# EAGLE design CR1000X small (EAGLE 9.6.2)
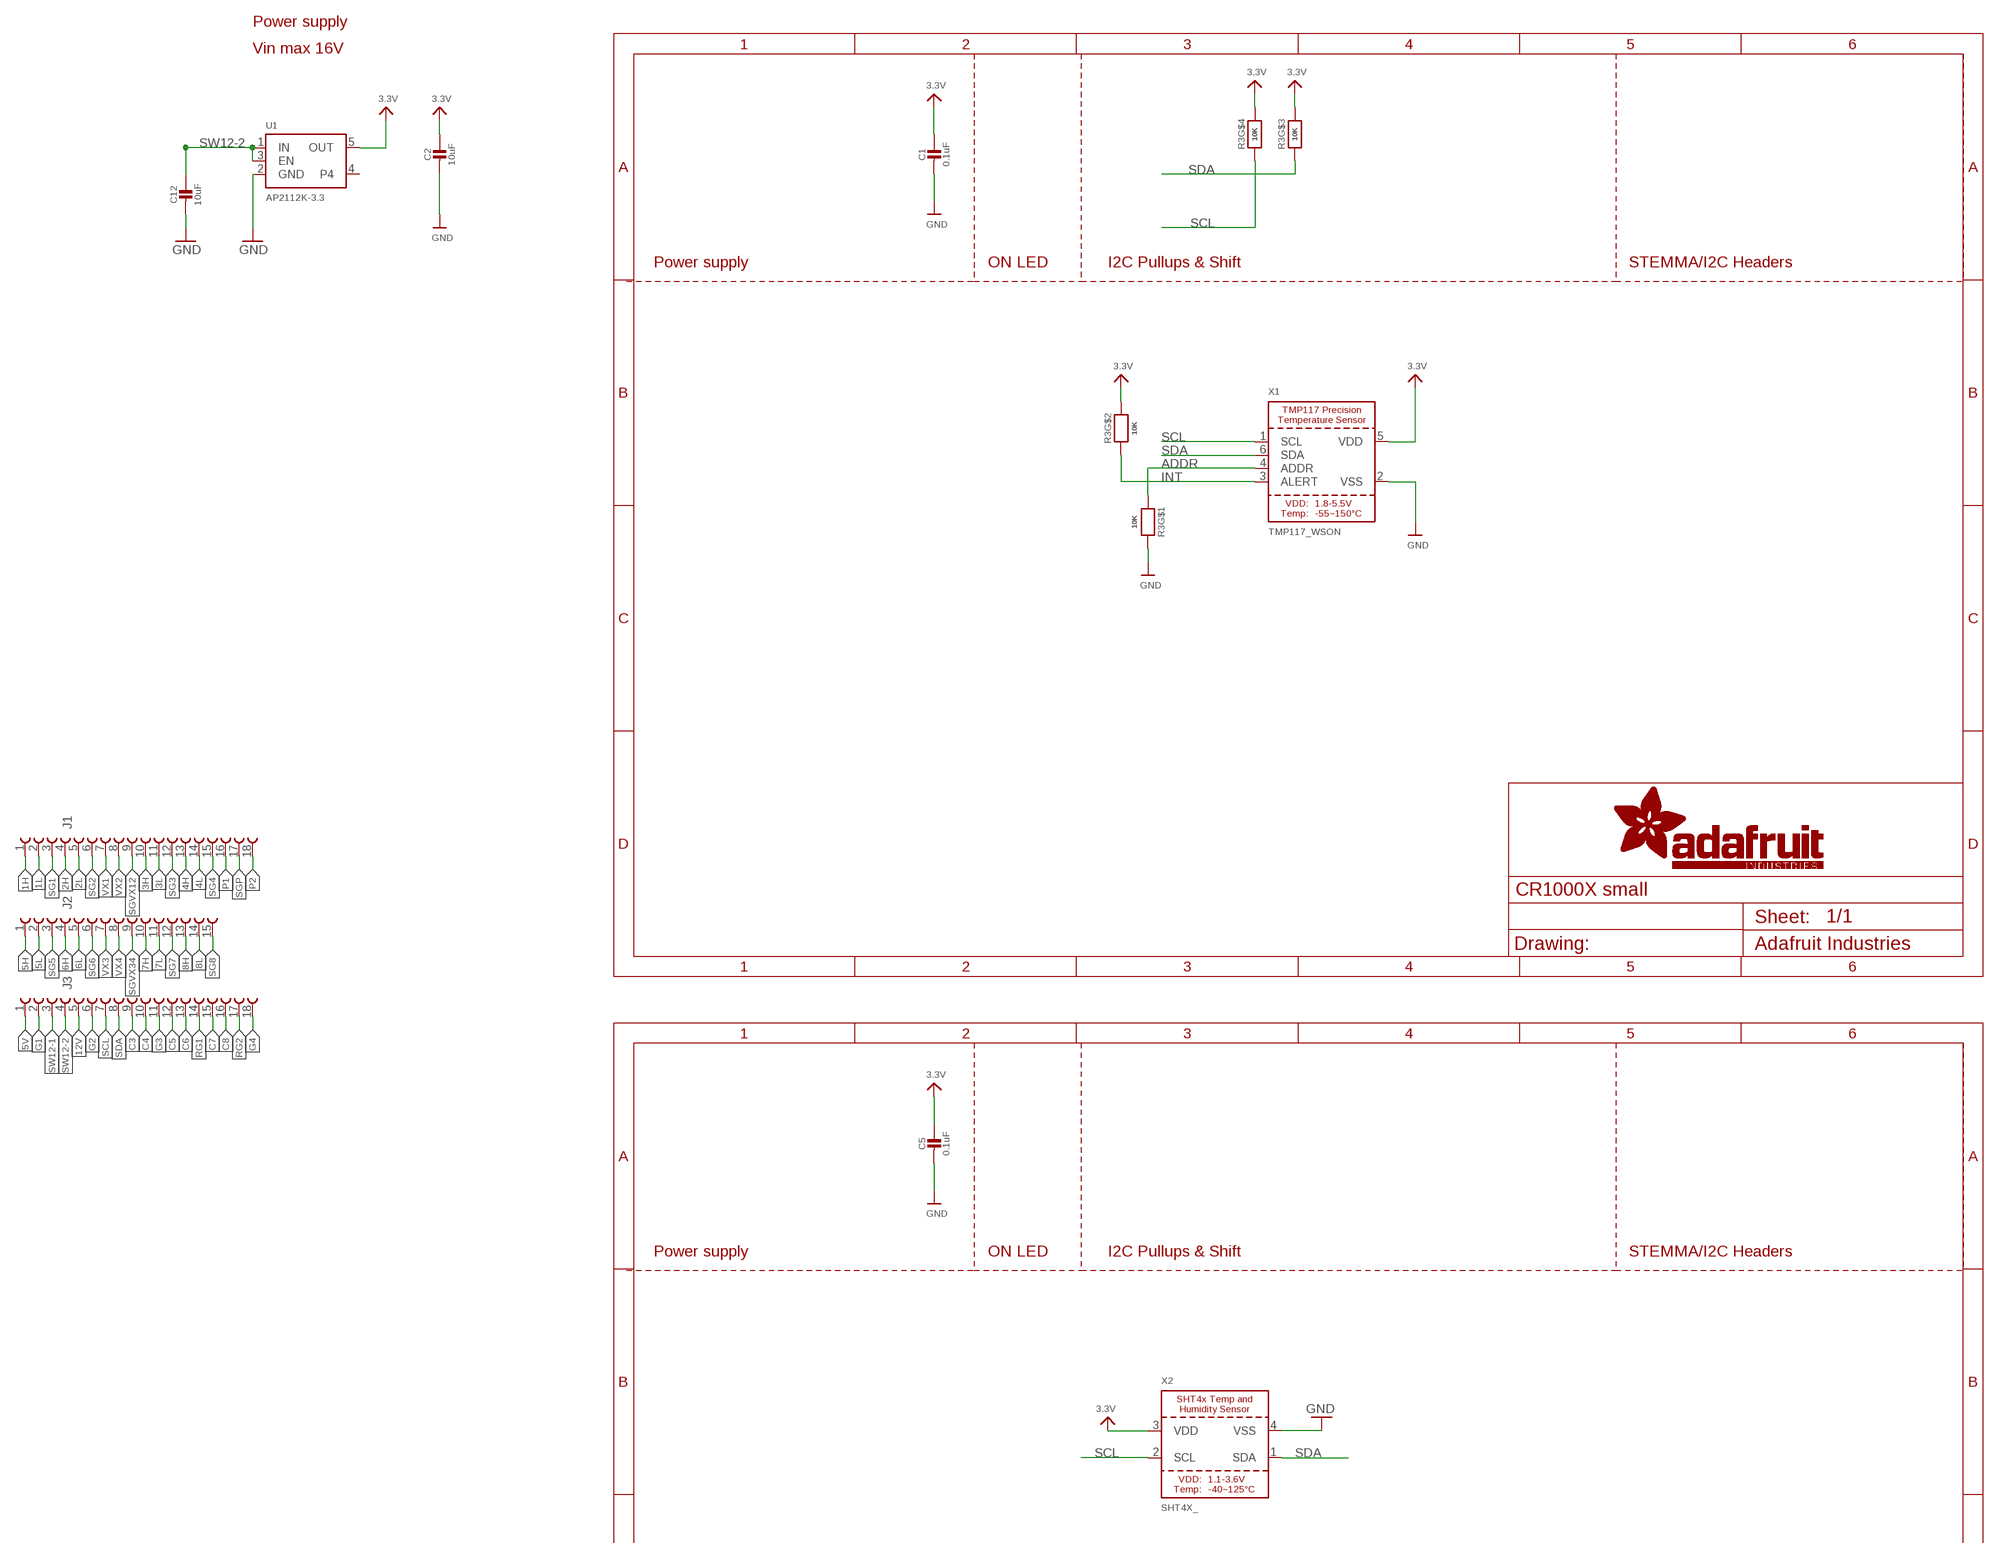
[diagram p0: schematic, sheet 1, part 1 of 2]
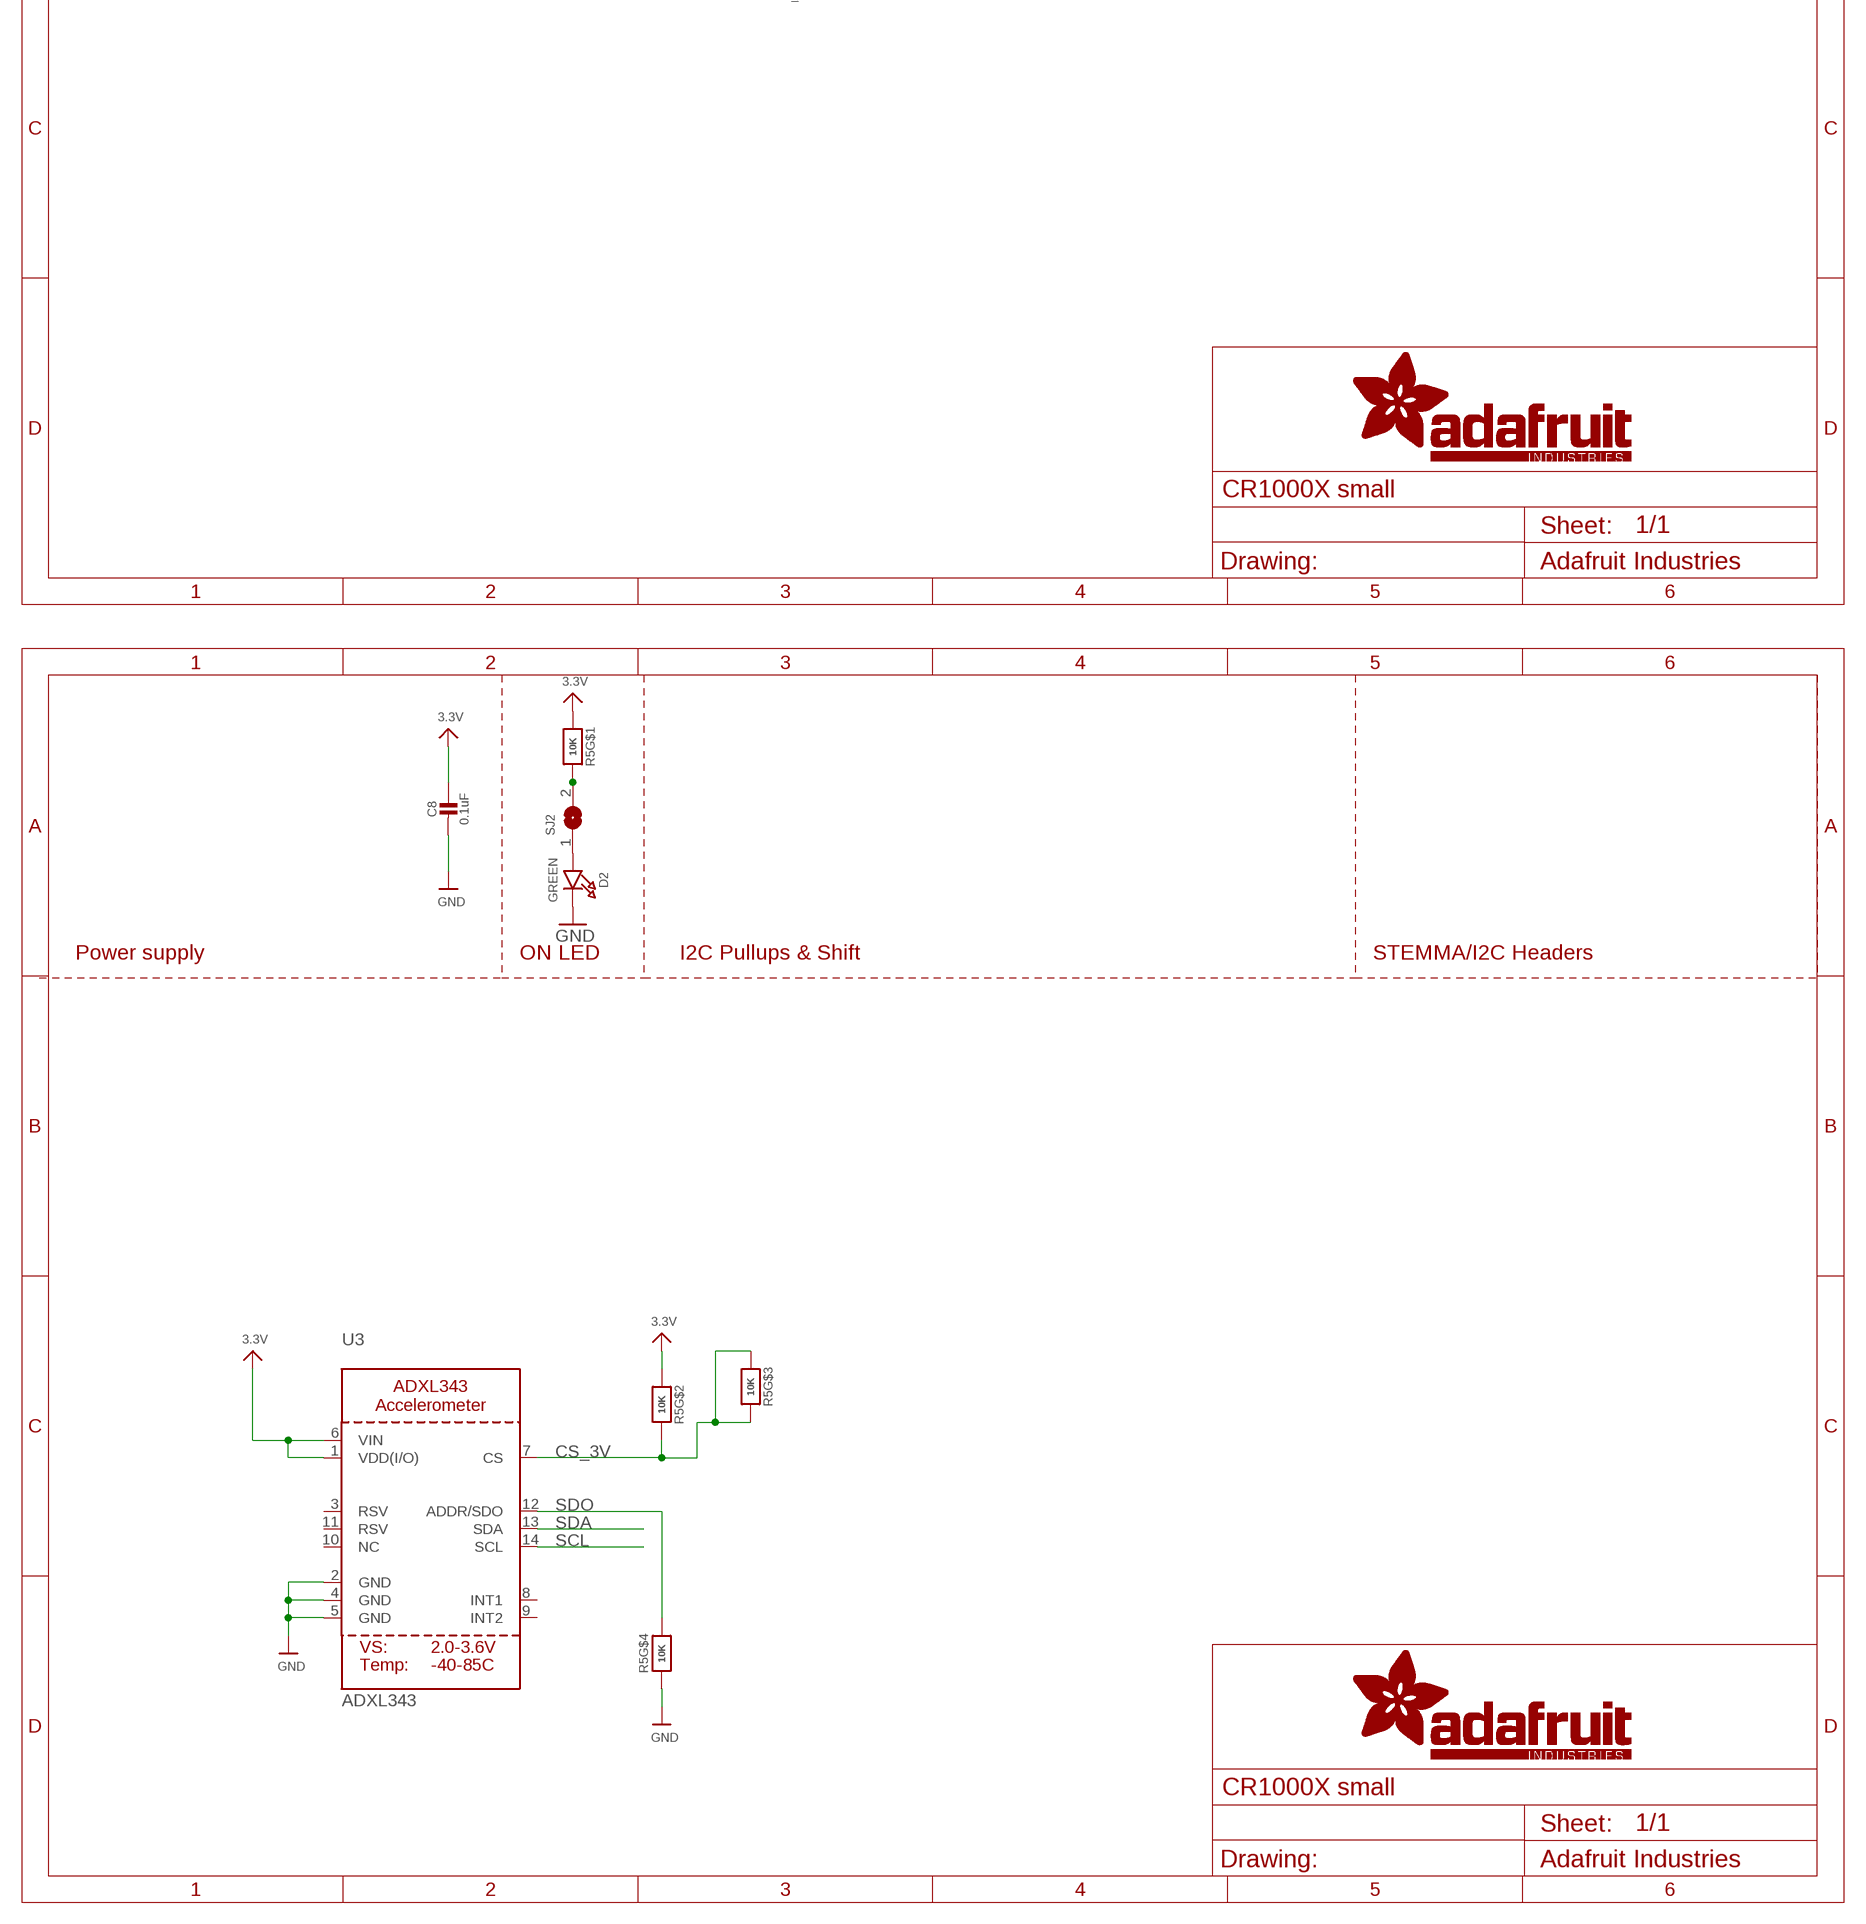
[diagram p1: schematic, sheet 1, part 2 of 2]

## Parts
C1  0.1uF  CAP_CERAMIC0603_NO  [0603-NO]
C2  10uF  CAP_CERAMIC0805-NOOUTLINE  [0805-NO]
C5  0.1uF  CAP_CERAMIC0603_NO  [0603-NO]
C8  0.1uF  CAP_CERAMIC0603_NO  [0603-NO]
C12  10uF  CAP_CERAMIC0805-NOOUTLINE  [0805-NO]
D2  GREEN  LED0603_NOOUTLINE  [CHIPLED_0603_NOOUTLINE]
J1  691311500018  [691311500018]
J2  691311500015  [691311500015]
J3  691311500018  [691311500018]
R3  10K  RESISTOR_4PACK  [RESPACK_4X0603]
R5  10K  RESISTOR_4PACK  [RESPACK_4X0603]
SJ2  SOLDERJUMPERCLOSED  [SOLDERJUMPER_CLOSEDWIRE]
U1  AP2112K-3.3  VREG_SOT23-5  [SOT23-5]
U3  ADXL343  ACCEL_ADXL343  [LGA14]
X1  TMP117_WSON  [WSON-6]
X2  SHT4X_  [SHT4X]

## Nets
1H: J1.1
1L: J1.2
2H: J1.4
2L: J1.5
3.3V [lowpower]: C1.1 C2.1 C5.1 C8.1 R3.5 R3.6 R3.7 R5.1 R5.2 U1.5(OUT) U3.1(VDD(I/O)) U3.6(VIN) X1.5(VDD) X2.3(VDD)
3H: J1.10
3L: J1.11
4H: J1.13
4L: J1.14
5H: J2.1
5L: J2.2
5V: J3.1
6H: J2.4
6L: J2.5
7H: J2.10
7L: J2.11
8H: J2.13
8L: J2.14
12V: J3.5
ADDR: R3.1 X1.4(ADDR)
C3: J3.9
C4: J3.10
C5: J3.12
C6: J3.13
C7: J3.15
C8: J3.16
CS_3V: R5.3 R5.6 R5.7 U3.7(CS)
G1: J3.2
G2: J3.6
G3: J3.11
G4: J3.18
GND [power]: C1.2 C2.2 C5.2 C8.2 C12.2 D2.C R3.8 R5.4 U1.2(GND) U3.2(GND) U3.4(GND) U3.5(GND) X1.2(VSS) X2.4(VSS)
INT: R3.2 X1.3(ALERT)
N$2: R5.8 SJ2.2
N$3: D2.A SJ2.1
P1: J1.16
P2: J1.18
RG1: J3.14
RG2: J3.17
SCL: J3.7 R3.4 U3.14(SCL) X1.1(SCL) X2.2(SCL)
SDA: J3.8 R3.3 U3.13(SDA) X1.6(SDA) X2.1(SDA)
SDO: R5.5 U3.12(ADDR/SDO)
SG1: J1.3
SG2: J1.6
SG3: J1.12
SG4: J1.15
SG5: J2.3
SG6: J2.6
SG7: J2.12
SG8: J2.15
SGP: J1.17
SGVX12: J1.9
SGVX34: J2.9
SW12-1: J3.3
SW12-2: C12.1 J3.4 U1.1(IN) U1.3(EN)
VX1: J1.7
VX2: J1.8
VX3: J2.7
VX4: J2.8
Unconnected: U1.4 U3.3(RSV) U3.8(INT1) U3.9(INT2) U3.10(NC) U3.11(RSV)

## Notes on the sheet
- Power supply
- Vin max 16V
- Power supply | ON LED | I2C Pullups & Shift | STEMMA/I2C Headers
- Power supply | ON LED | I2C Pullups & Shift | STEMMA/I2C Headers
- Power supply | ON LED | I2C Pullups & Shift | STEMMA/I2C Headers

## Library data of the parts
C1 C2 C5 C8 C12 = microbuilder:CAP_CERAMIC: Ceramic Capacitors For new designs, use the packages preceded by an '_' character since they are more reliable: The following footprints should be used on most boards: _0402 - Standard footprint for regular board layouts _0603 - Standard footprint for regular board layouts _0805 - Standard footprint for regular board layouts _1206 - Standard footprint for regular board layouts For extremely tight-pitch boards where space is at a premium, the following 'micro-pitch' footprints can be used (smaller pads, no silkscreen outline, etc.): _0402MP - Micro-pitch footprint for very dense/compact boards _0603MP - Micro-pitch footprint for very dense/compact boards _0805MP - Micro-pitch footprint for very dense/compact boards _1206MP - Micro-pitch footprint for very dense/compact boards
D2 = microbuilder:LED: LED 0603 - 0603 Surface Mount Package 2mA: Green LED - Low Power (3.9mcd, 2ma, 1.7Vf) - Digikey: 475-2709-2-ND Orange LED - Low Power (9.8mcd, 2ma, 1.8Vf) - Digikey: 475-1194-2-ND Red LED - Low Power (5mcd, 2ma, 1.8Vf) - Digikey: 475-1195-2-ND Yellow LED - Low Power (7mcd, 2ma, 1.8Vf) - Digikey: 475-1196-2-ND 5mA: Blue LED - Low Power (17mcd, 5ma, 2.9Vf) - Digikey: LNJ937W8CRACT-ND 0805 - 0805 Surface Mount Package 2mA: Red LED (8.8mcd, 2mA, 1.8Vf, Clear) - Low Power [Digikey: 475-2510-1-ND] Green LED (5mcd, 2mA, 1.8Vf, Clear) - Low Power [Digikey: 475-2730-1-ND] Yellow LED (11.3mcd, 2mA, 1.8Vf, Clear) - Low Power [Digikey: 475-2555-1-ND] 20mA: Red LED (104mcd, 20mA, Diffused) - LS R976 [Digikey: 475-1278-6-ND] Red LED (12mcd, 20mA, 2.0Vf, Clear) - APT2012EC [Digikey: 754-1128-1-ND] Green LED (15mcd, 20mA, 2.2Vf, Clear) - APT2012GC [Digikey: 754-1131-1-ND] Orange LED (160mcd, 20mA, 2.1Vf, Clear) - APT2012SECK [Digikey: 754-1130-1-ND] 1206 - 1206 Surface Mount Package Green LED (26mcd, 20mA, Diffused) - LG N971 [Digikey: 475-1407-6-ND] Red LED (15mcd, 20mA, Diffused) - LH N974 [Digikey: 475-1416-6-ND] Cree - Cree High-Power Surface Mount LEDs XPEBWT-L1-0000-00D50 - White 111lm 350mA 2.9Vf 6200K 110° XTEAWT-00-0000-00000LEE3 - White 114lm 350mA 2.85Vf 5000K 115° Everlight - Everlight 45-21 Series Surface Mount LEDs 45-21/QK2C-B2832AC2CB2/2T - Warm White 2000mcd 20mA 3.25Vf 3050K 120° 45-21/LK2C-B38452C4CB2/2T - Nuetral White 2000mcd 20mA 3.25Vf 4150K 120° 45-21/LK2C-B50634C6CB2/2T - Cold White 2200mcd 20mA 3.25Vf 5650K 120° PLCC2 Reverse Mount LS T77K-J1L2-1-0-2-R18-Z - Red 11.25mcd 2mA 1.8Vf 630nm 120° LO T77K-L1M2-24-Z - Orange 19.6mcd 2mA 1.8Vf 606nm 120° LY T77K-K2M1-26-Z - Yellow 15.7mcd 2mA 1.8Vf 587nm 120°
J1 J3 = Wurth_Elektronik_Electromechanic_Terminal_Blocks_Connectors_rev19d:691311500018: WR-TBL Serie 311 - 5.08 mm Open Vertical PCB Header , 18 Pins=>Code : Con_TBL_Pluggable_5.08_PCB_THT_Simple_V_691311500018 <http://katalog.we-online.de/media/images/eican/Con_TBL_Pluggable_5.08_PCB_THT_Simple_V_6913115000xx_pf2.jpg> Details see: http://katalog.we-online.de/en/em/TBL_5_08_311_OPEN_VERTICAL_PCB_HEADER_6913115000XX Created 2014-06-23, Karrer Zheng 2014 (C) Würth Elektronik
J2 = Wurth_Elektronik_Electromechanic_Terminal_Blocks_Connectors_rev19d:691311500015: WR-TBL Serie 311 - 5.08 mm Open Vertical PCB Header , 15 Pins=>Code : Con_TBL_Pluggable_5.08_PCB_THT_Simple_V_691311500015 <http://katalog.we-online.de/media/images/eican/Con_TBL_Pluggable_5.08_PCB_THT_Simple_V_6913115000xx_pf2.jpg> Details see: http://katalog.we-online.de/en/em/TBL_5_08_311_OPEN_VERTICAL_PCB_HEADER_6913115000XX Created 2014-06-23, Karrer Zheng 2014 (C) Würth Elektronik
R3 R5 = microbuilder:RESISTOR_4PACK: Resistor Packs (4 resistors) 4 x 0603 10K 1/16W - Digikey: YC164J-10KCT-ND
SJ2 = microbuilder:SOLDERJUMPER: SMD Solder JUMPER Solder the two pads together to create a connection, or remove the solder to break it. REFLOW - Use this footprint for solder paste and reflow ovens. WAVE - Use this footprint for hand-soldering (larger pads). CLOSED - Has a trace between the two pads to ensure it is closed by default. The trace needs to be cut to disable the jumper, and can be closed again by creating a solder bridge between the two pads.
U1 = adafruit_power:VREG_SOT23-5: SOT23-5 Fixed Voltage Regulators Part Current Out V Out V In V Dropout θJA (°C/W) TJ (°C) Digikey Part No. ADP121 150mA 3.3V 3.4-5.5V 0.09V @ 150mA -- -- ADP121-AUJZ33R7CT-ND ADP121 150mA 3.0V 3.1-5.5V 0.09V @ 150mA -- -- ADP121-AUJZ30R7CT-ND ADP122 300mA 3.3V 3.4-5.5V 0.085V @ 300mA -- -- ADP122AUJZ-3.3-R7CT-ND ADP1712 300mA 3.3V 3.5-5.5V 0.17V @ 300mA -- -- ADP1712AUJZ-3.3-R7TR-ND AP7311 (Low Cost) 150mA 3.3V 3.5-6V 0.15V @ 150mA -- -- AP7311-33WG-7DICT-ND LD39015M18R 150mA 1.8V 1.9V-5.5V 0.08V @ 100mA -- -- 497-6977-1-ND LP2985A-33DBVR 150mA 3.3V 3.3-16V 0.28V @ 150mA 206 150 296-18479-1-ND MCP1824T-3302E/OT 300mA 3.3V 3.5V-6V 0.2V @ 300mA -- -- MCP1824T-3302E/OTCT-ND MIC5205-2.5YM5 TR 150mA 2.5V 2.7-16V 0.165V @ 150mA -- -- 576-1257-2-ND MIC5205-3.0YM5 TR 150mA 3.0V 3.2V-16V 0.165V @ 150mA -- -- 576-1258-2-ND MIC5205-3.3YM5 TR 150mA 3.3V 3.5V-16V 0.165V @ 150mA -- -- 576-1259-2-ND TPS780330220 150mA 3.3V+2.2V 3.6-5.5V 250mV Max -- -- 296-23332-1-ND TDA3663/N1,135 100mA 3.3V 3.5-45V 0.18V @ 50mA -- -- 568-5343-1-ND Max operating temp can be calculated using θJA, TJ (max junction temperature), and power in watts. Set the "Maximum Ambient Temperature" until it reaches TJ ("Max Junction Temperature"), which is the absolute limit for safe use of the regulator: Heat Sink Temperature Calculator <http://www.daycounter.com/Calculators/Heat-Sink-Temperature-Calculator.phtml> For example, With 12V source into a 3.3V LP2985 and a 30mA load, we are dissipating (12V-3.3V) * 0.03A = 0.261W. With a θJA of 206 °C/W, a TJ of 150°C, and 261mW we can safely use the chip without a heat sink up to 75°C (=147.1°C Junction Temperature).
U3 = microbuilder:ACCEL_ADXL343: ADXL343 - Digital Accelerometer 2/4/8/16g
X1 = adafruit_sensor:TMP117
X2 = adafruit_sensor:SHT4X

## Net classes
1 power: width 0.305 mm, drill 0.483 mm, clearance 0.203 mm
2 lowpower: width 0.254 mm, drill 0.483 mm

## Board
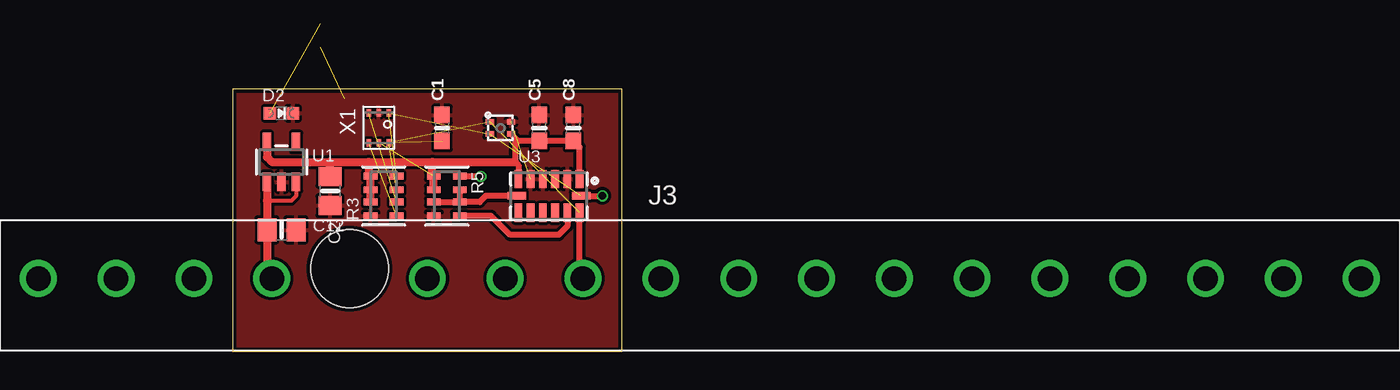
[diagram p2: board, top side]
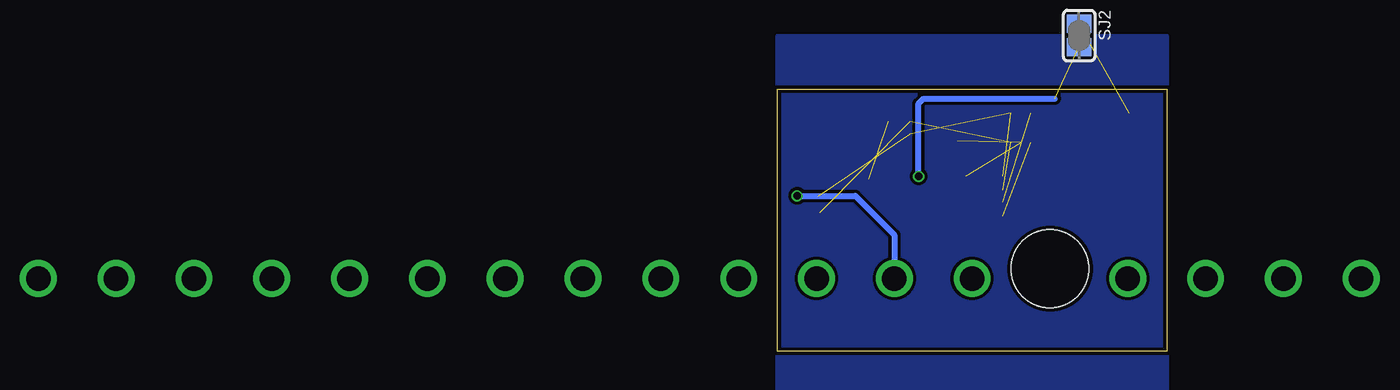
[diagram p3: board, bottom side, seen from below]

Size 25.4 x 17.14 mm. Coordinates in mm from the lower left corner, seen from the top.
Outline: 0,0 25.4,0 25.4,17.15 0,17.15 0,0
Copper layers (1*16): Top 0.018mm / dielectric 1.55mm / Bottom 0.018mm
Design rules "eC_2Layer_PClass6_BaseCopperO18_eCDefault": minimum track width 0.15mm, minimum drill 0.35mm, track to track 0.15mm, track to pad 0.15mm, pad to pad 0.15mm, via to via 0.15mm, smd to smd 0mil, copper to edge 0.25mm, drill to drill 0.35mm, minimum pad ring 0.175mm, minimum via ring 0.125mm, stop-mask expansion 0mil, vias tented up to drill 0.45mm, thermal gap 0.2mm
Holes 5.08 mm at 7.62,5.4

### Footprints (pad centres in the part's own frame; a part is rotated, then mirrored left to right if it is on the bottom)
0603-NO = smd 1.075 x 1: 1 -0.85,0; 2 0.85,0
0805-NO = smd 1.24 x 1.5: 1 -0.95,0; 2 0.95,0
CHIPLED_0603_NOOUTLINE = smd 0.8 x 0.8: A 0,-0.75; C 0,0.75
691311500018 = drill 1.6: 1 -43.18,0; 2 -38.1,0; 3 -33.02,0; 4 -27.94,0; 5 -22.86,0; 6 -17.78,0; 7 -12.7,0; 8 -7.62,0; 9 -2.54,0; 10 2.54,0; 11 7.62,0; 12 12.7,0; 13 17.78,0; 14 22.86,0; 15 27.94,0; 16 33.02,0; 17 38.1,0; 18 43.18,0
691311500015 = drill 1.6: 1 -35.56,0; 2 -30.48,0; 3 -25.4,0; 4 -20.32,0; 5 -15.24,0; 6 -10.16,0; 7 -5.08,0; 8 0,0; 9 5.08,0; 10 10.16,0; 11 15.24,0; 12 20.32,0; 13 25.4,0; 14 30.48,0; 15 35.56,0
RESPACK_4X0603 = smd 0.45 x 0.9: 1 -1.3,-0.85; 2 -0.4,-0.85; 3 0.4,-0.85; 4 1.3,-0.85; 5 1.3,0.85; 6 0.4,0.85; 7 -0.4,0.85; 8 -1.3,0.85
SOLDERJUMPER_CLOSEDWIRE = smd 1.168 x 1.6: 1 -0.762,0; 2 0.762,0 | smd 0.635 x 0.203: WIRE 0,0
SOT23-5 = smd 0.55 x 1.2: 1 -0.95,-1.3; 2 0,-1.3; 3 0.95,-1.3; 4 0.95,1.3; 5 -0.95,1.3
LGA14 = smd 0.5 x 1.2: 1 2,1.1; 2 1.2,1.1; 3 0.4,1.1; 4 -0.4,1.1; 5 -1.2,1.1; 6 -2,1.1; 8 -2,-1.1; 9 -1.2,-1.1; 10 -0.4,-1.1; 11 0.4,-1.1; 12 1.2,-1.1; 13 2,-1.1 | smd 1.2 x 0.5: 7 -2.1,0; 14 2.1,0
WSON-6 = smd 0.45 x 0.3: 1 -0.975,0.65; 2 -0.975,0; 3 -0.975,-0.65; 4 0.975,-0.65; 5 0.975,0; 6 0.975,0.65
SHT4X = smd 0.55 x 0.35: 1 -0.7,0.4; 2 -0.7,-0.4; 3 0.7,-0.4; 4 0.7,0.4

### Placement (x,y rotation side)
C1  13.65,14.61 90 top
C2  6.35,10.48 270 top
C5  20,14.61 90 top
C8  22.22,14.61 90 top
C12  3.18,7.94 0 top
D2  3.18,15.56 270 top
J1  30.48,63.18 0 top  (outside the outline)
J2  22.86,33.97 0 top  (outside the outline)
J3  30.48,4.76 0 top
R3  9.84,10.16 90 top
R5  13.97,10.16 270 top
SJ2  5.71,20.64 270 bottom
U1  3.18,12.38 0 top
U3  20.64,10.16 0 top
X1  9.53,14.61 270 top
X2  17.46,14.61 0 top

### Tracks (layer width: path | path; a pad name or v marks a point on that pad's centre or on a via)
3.3V  (2 unrouted)
  Top 0.406: U3.1 22.64,13.34 C8.1 C5.1 18.61,13.75 | 18.61,13.75 X2.3 | 18.61,13.75 18.41,13.56 18.41,12.38 18.64,12.16 U3.6
  Top 0.508: R3.7 R3.6 R3.5 8.89,11.56 8.89,12.38 | U1.5 2.23,12.7 2.54,12.38 6.35,12.38 | 6.35,12.38 8.89,12.38 | C2.1 6.35,12.38 | 8.89,12.38 13.02,12.38 | 13.02,12.38 18.41,12.38 | R5.2 R5.1 13.02,11.56 13.02,12.38
ADDR  (1 unrouted)
CS_3V
  Top 0.406: R5.3 R5.6 | R5.6 R5.7 | U3.7 16.51,10.16 16.11,9.76 R5.6
GND  (1 unrouted)
  pour Top: 0,18.73 0,-7.62 25.4,-7.62 25.4,18.73
  pour Bottom: 0,-10.48 25.4,-10.48 25.4,20.64 0,20.64
INT  (1 unrouted)
N$2  (via drill 0.48)  (1 unrouted)
  Top 0.406: R5.8 16.16,11.46 v16.19,11.43
  Bottom 0.406: v16.19,11.43 16.19,16.19 15.88,16.51 7.3,16.51
N$3  (1 unrouted)
SCL  (via drill 0.48)  (3 unrouted)
  Top 0.406: U3.14 v24.13,10.16
  Bottom 0.406: v24.13,10.16 20.32,10.16 17.78,7.62 J3.7
SDA  (3 unrouted)
  Top 0.406: J3.8 22.64,4.99 U3.13
SDO
  Top 0.406: U3.12 21.84,8.18 21.27,7.62 18.1,7.62 16.86,8.86 R5.5
SW12-2
  Top 0.254: U1.3 4.12,10.16 3.81,9.84 2.23,9.84
  Top 0.508: U1.1 2.23,9.84 C12.1 2.23,5.08 J3.4